# EasyEDA schematic SCH_Doly_CE_Charger_2212.json
TITLE: DOLY charger board; REV: 1.0; Date: 2020-12-31; Sheet: 1/1; Drawn By: Levent Erenler; Company: Limitbit Technology Inc
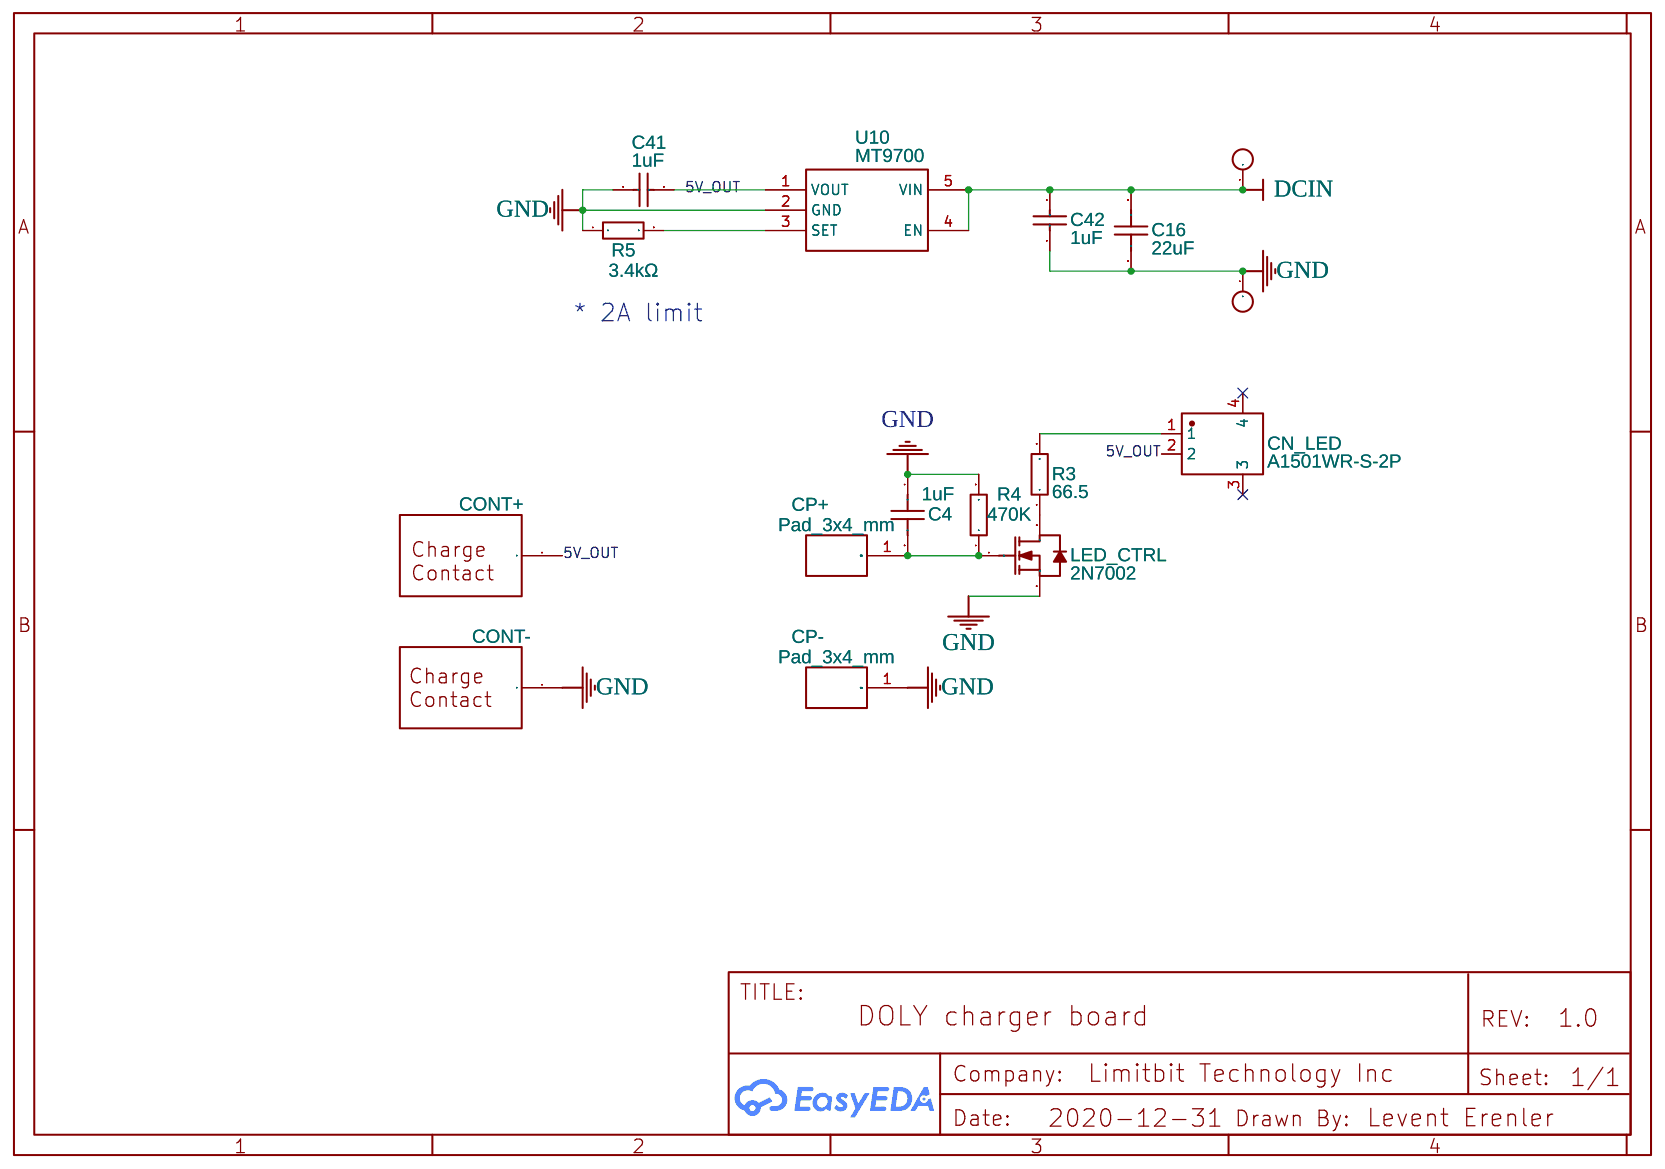
[diagram p0: schematic sheet]

## Parts
+5V  TP_1.5MM  [PAD_2.5*5]
-  TP_1.5MM  [PAD_2.5*5]
C4  1uF  [0603]
C16  22uF  [C0603]
C41  1uF  [C0603]
C42  1uF  [C0603]
CN_LED  A1501WR-S-2P  [CONN-SMD_A1501WR-S-2P]
CONT+  DockChargeContact  [DOCK_CONTACT]
CONT-  DockChargeContact  [DOCK_CONTACT]
CP+  Pad_3x4_mm  [PAD_3X4_MM]
CP-  Pad_3x4_mm  [PAD_3X4_MM]
LED_CTRL  2N7002  [SOT-23]
R3  66.5  [R0603]
R4  470K  [R0603]
R5  3.4kΩ  [R0603]
U10  MT9700  [SOT-23-5_L3.0-W1.7-P0.95-LS2.8-BR]

## Library data of the parts
+5V - = TP_1.5MM: Contributor: sebasiano
C4 = CL10A106KP8NNNC: Supplier: LCSC; Manufacturer: SAMSUNG; Manufacturer Part: CL10A105KP8NNNC; LCSC Assembly: Yes; Supplier Part: C26413
C16 = GRM188R61A226ME15D: Supplier: LCSC; Manufacturer: MuRata; Supplier Part: C84419
C41 C42 = CL10A105KA8NNNC: Supplier: LCSC; Manufacturer: SAMSUNG; Supplier Part: C5673; JLCPCB Part Class: Extended Part
CN_LED = A1501WR-S-2P: Supplier: LCSC; Supplier Part: C225167; Manufacturer: Changjiang Connectors; Contributor: LCSC; Paste Type: Extended Part; JLCPCB Part Class: Extended Part
CONT+ CONT- = DockChargeContact: Contributor: lerenler
CP+ CP- = Pad_3x4_mm: Contributor: lerenler
LED_CTRL = -: Supplier: LCSC; Manufacturer: SK; Manufacturer Part: 2N7002(Silk screen12W); Supplier Part: C111581
R3 = 0603WAF665JT5E: Supplier: LCSC; Manufacturer: UniOhm; Supplier Part: C23226; JLCPCB Part Class: Extended Part
R4 = 0603WAF4703T5E: Supplier: LCSC; Manufacturer: UniOhm; Supplier Part: C23178; JLCPCB Part Class: Basic Part
R5 = 0603WAF3401T5E: Supplier: LCSC; Manufacturer: UNI-ROYAL(厚声); Supplier Part: C22997; Resistance (Ohms): 3.4K; JLCPCB Part Class: Extended Part
U10 = MT9700: Supplier: LCSC; Manufacturer: AEROSEMI; Supplier Part: C89855; JLCPCB Part Class: Extended Part

## Nets
5V_OUT: C41.1 CN_LED.2 CONT+.1 U10.1(VOUT)
GND: -.1 C4.1 C16.1 C41.2 C42.2 CONT-.1 CP-.1(CN_3x4mm) LED_CTRL.2(S) R4.2 R5.1 U10.2(GND)
DCIN: +5V.1 C16.2 C42.1 U10.4(EN) U10.5(VIN)
Net-(C4-2): C4.2 CP+.1(CN_3x4mm) LED_CTRL.1(G) R4.1
Net-(CN_LED-1): CN_LED.1 R3.2
Net-(LED_CTRL-3): LED_CTRL.3(D) R3.1
Net-(R5-2): R5.2 U10.3(SET)

Not connected (* = marked no-connect by the designer): CN_LED 3* 4*

## Notes on the sheet
- * 2A limit
